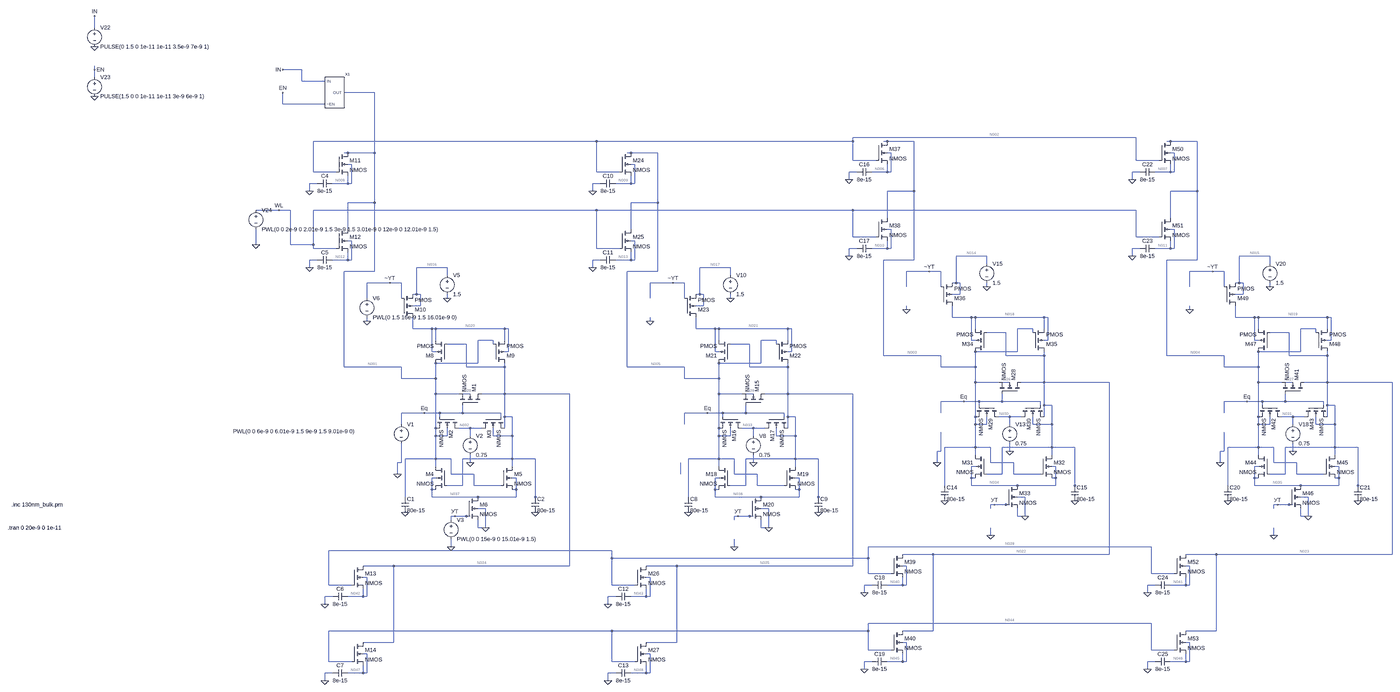
[diagram p0: schematic Draft2.asc, whole sheet]
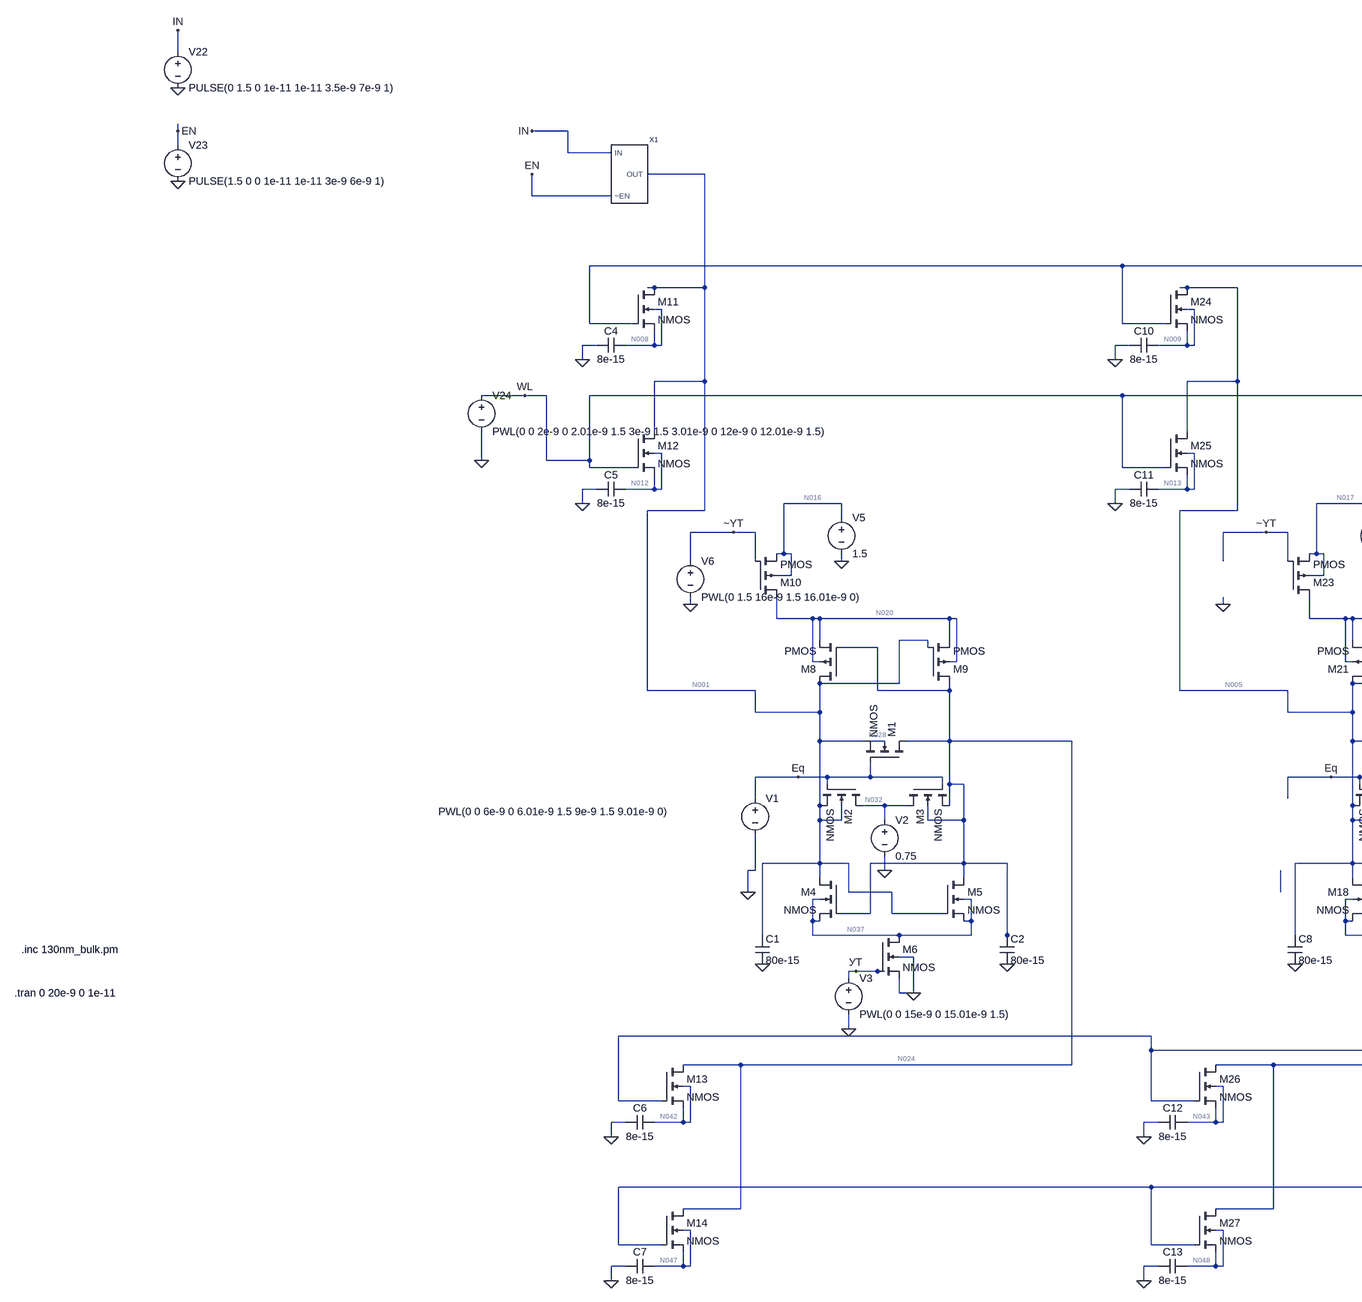
[diagram p1: schematic Draft2.asc, part, row 1 of 1, column 1 of 2]
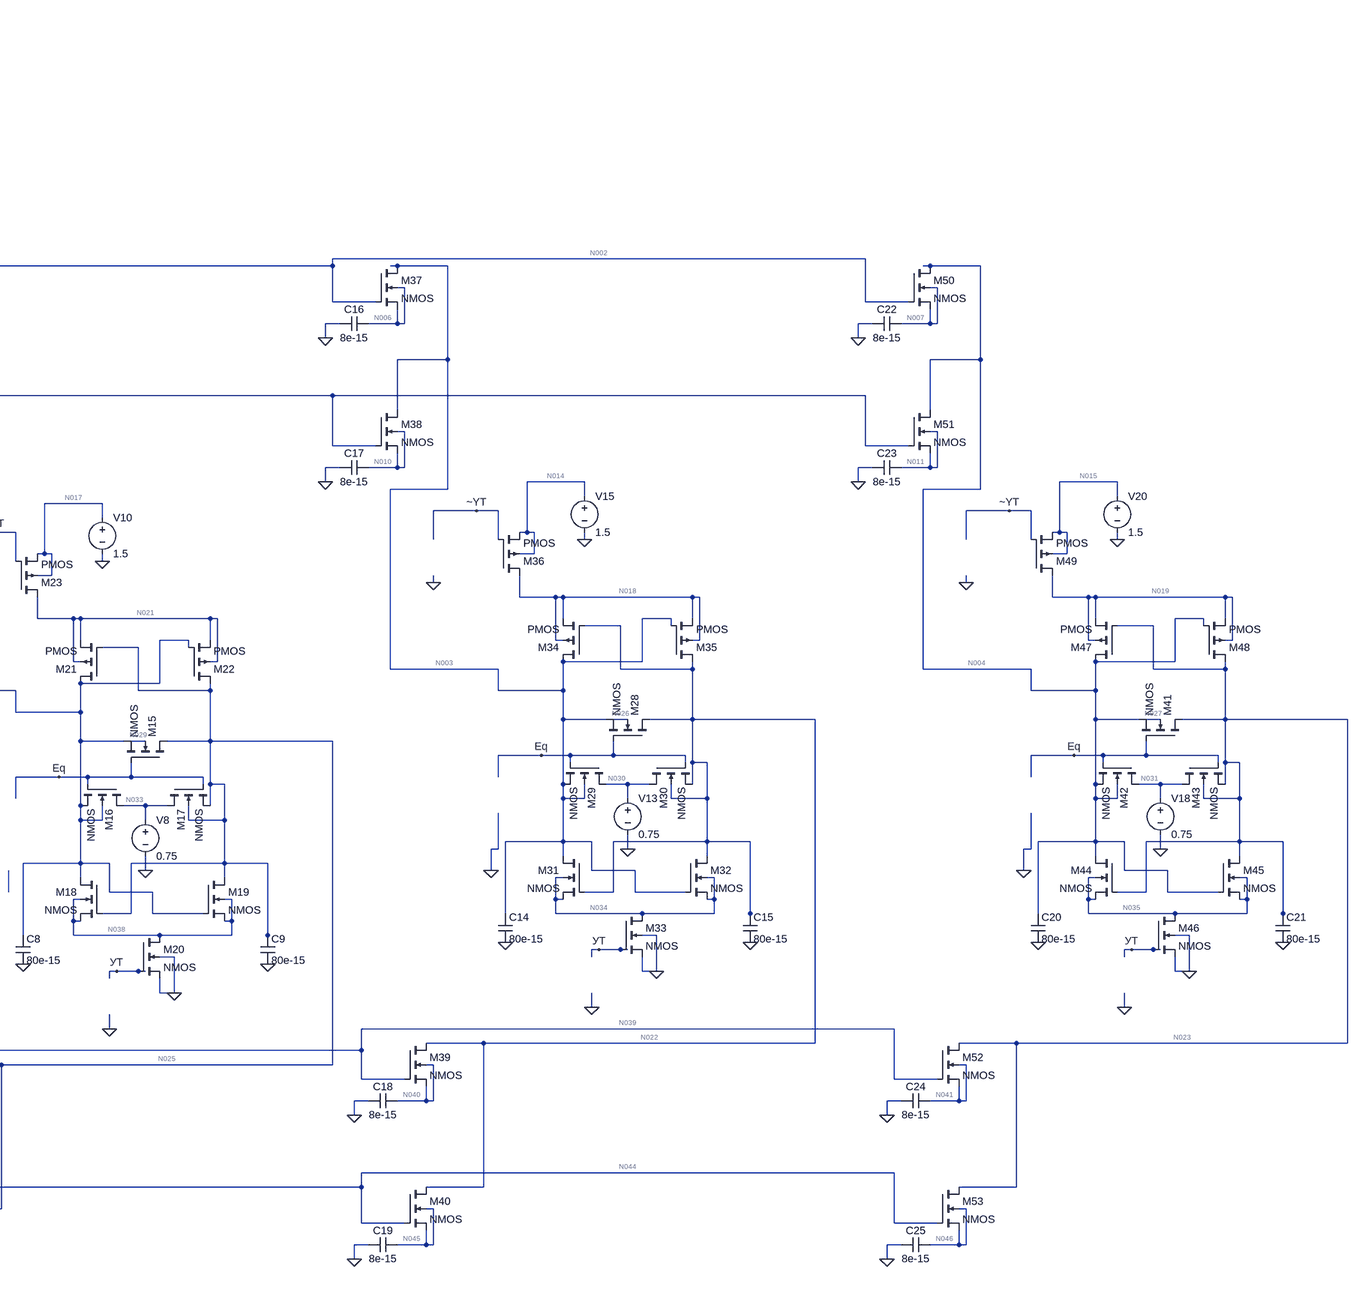
[diagram p2: schematic Draft2.asc, part, row 1 of 1, column 2 of 2]
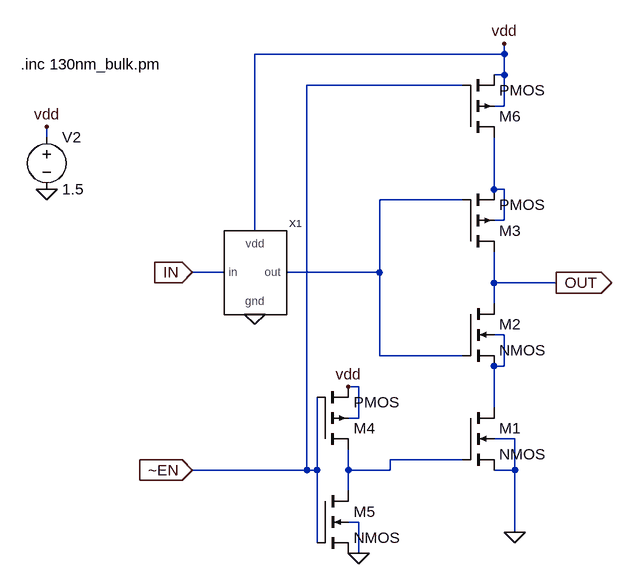
[diagram p3: sub-circuit three_state.asc]
Draft2.asc, the LTspice schematic file:
Version 4
SHEET 1 4548 1444
WIRE -928 -1360 -928 -1408
WIRE -928 -1184 -928 -1200
WIRE -16 -1184 -96 -1184
WIRE -928 -1152 -928 -1184
WIRE -16 -1136 -16 -1184
WIRE 80 -1136 -16 -1136
WIRE 288 -1088 160 -1088
WIRE -96 -1040 -96 -1088
WIRE 80 -1040 -96 -1040
WIRE 3472 -848 2288 -848
WIRE 1216 -832 32 -832
WIRE 2288 -832 2288 -848
WIRE 2288 -832 1216 -832
WIRE 2432 -832 2416 -832
WIRE 2544 -832 2432 -832
WIRE 3616 -832 3600 -832
WIRE 3728 -832 3616 -832
WIRE 176 -784 160 -784
WIRE 288 -784 288 -1088
WIRE 288 -784 176 -784
WIRE 1360 -784 1344 -784
WIRE 1472 -784 1360 -784
WIRE 2448 -784 2432 -784
WIRE 3632 -784 3616 -784
WIRE 2288 -752 2288 -832
WIRE 2384 -752 2288 -752
WIRE 3472 -752 3472 -848
WIRE 3568 -752 3472 -752
WIRE 192 -736 176 -736
WIRE 1376 -736 1360 -736
WIRE 32 -704 32 -832
WIRE 128 -704 32 -704
WIRE 1216 -704 1216 -832
WIRE 1312 -704 1216 -704
WIRE 2304 -704 2272 -704
WIRE 2432 -704 2432 -736
WIRE 2432 -704 2368 -704
WIRE 2448 -704 2448 -784
WIRE 2448 -704 2432 -704
WIRE 3488 -704 3456 -704
WIRE 3616 -704 3616 -736
WIRE 3616 -704 3552 -704
WIRE 3632 -704 3632 -784
WIRE 3632 -704 3616 -704
WIRE 2272 -672 2272 -704
WIRE 3456 -672 3456 -704
WIRE 48 -656 16 -656
WIRE 176 -656 176 -688
WIRE 176 -656 112 -656
WIRE 192 -656 192 -736
WIRE 192 -656 176 -656
WIRE 1232 -656 1200 -656
WIRE 1360 -656 1360 -688
WIRE 1360 -656 1296 -656
WIRE 1376 -656 1376 -736
WIRE 1376 -656 1360 -656
WIRE 16 -624 16 -656
WIRE 1200 -624 1200 -656
WIRE 2544 -624 2544 -832
WIRE 2544 -624 2432 -624
WIRE 3728 -624 3728 -832
WIRE 3728 -624 3616 -624
WIRE 288 -576 288 -784
WIRE 288 -576 176 -576
WIRE 1472 -576 1472 -784
WIRE 1472 -576 1360 -576
WIRE -112 -544 -208 -544
WIRE -64 -544 -112 -544
WIRE 1216 -544 32 -544
WIRE 2288 -544 1216 -544
WIRE 3472 -544 2288 -544
WIRE 2432 -512 2432 -624
WIRE 3616 -512 3616 -624
WIRE 176 -464 176 -576
WIRE 1360 -464 1360 -576
WIRE 2448 -464 2432 -464
WIRE 3632 -464 3616 -464
WIRE 2288 -432 2288 -544
WIRE 2384 -432 2288 -432
WIRE 3472 -432 3472 -544
WIRE 3568 -432 3472 -432
WIRE 192 -416 176 -416
WIRE 1376 -416 1360 -416
WIRE -208 -400 -208 -464
WIRE -64 -400 -64 -544
WIRE 32 -400 32 -544
WIRE 32 -400 -64 -400
WIRE 32 -384 32 -400
WIRE 128 -384 32 -384
WIRE 1216 -384 1216 -544
WIRE 1312 -384 1216 -384
WIRE 2304 -384 2272 -384
WIRE 2432 -384 2432 -416
WIRE 2432 -384 2368 -384
WIRE 2448 -384 2448 -464
WIRE 2448 -384 2432 -384
WIRE 3488 -384 3456 -384
WIRE 3616 -384 3616 -416
WIRE 3616 -384 3552 -384
WIRE 3632 -384 3632 -464
WIRE 3632 -384 3616 -384
WIRE 2272 -352 2272 -384
WIRE 2848 -352 2720 -352
WIRE 3456 -352 3456 -384
WIRE 4032 -352 3904 -352
WIRE 48 -336 16 -336
WIRE 176 -336 176 -368
WIRE 176 -336 112 -336
WIRE 192 -336 192 -416
WIRE 192 -336 176 -336
WIRE 1232 -336 1200 -336
WIRE 1360 -336 1360 -368
WIRE 1360 -336 1296 -336
WIRE 1376 -336 1376 -416
WIRE 1376 -336 1360 -336
WIRE 2544 -336 2544 -624
WIRE 2544 -336 2416 -336
WIRE 3728 -336 3728 -624
WIRE 3728 -336 3600 -336
WIRE 2848 -320 2848 -352
WIRE 4032 -320 4032 -352
WIRE 16 -304 16 -336
WIRE 592 -304 464 -304
WIRE 1200 -304 1200 -336
WIRE 1776 -304 1648 -304
WIRE 288 -288 288 -576
WIRE 288 -288 160 -288
WIRE 1472 -288 1472 -576
WIRE 1472 -288 1344 -288
WIRE 2608 -288 2512 -288
WIRE 2656 -288 2608 -288
WIRE 3792 -288 3696 -288
WIRE 3840 -288 3792 -288
WIRE 592 -272 592 -304
WIRE 1776 -272 1776 -304
WIRE 352 -240 256 -240
WIRE 400 -240 352 -240
WIRE 1536 -240 1440 -240
WIRE 1584 -240 1536 -240
WIRE 2720 -240 2720 -352
WIRE 2720 -240 2704 -240
WIRE 2736 -240 2720 -240
WIRE 3904 -240 3904 -352
WIRE 3904 -240 3888 -240
WIRE 3920 -240 3904 -240
WIRE 2512 -224 2512 -288
WIRE 2656 -224 2656 -288
WIRE 2848 -224 2848 -240
WIRE 3696 -224 3696 -288
WIRE 3840 -224 3840 -288
WIRE 4032 -224 4032 -240
WIRE 464 -192 464 -304
WIRE 464 -192 448 -192
WIRE 480 -192 464 -192
WIRE 1648 -192 1648 -304
WIRE 1648 -192 1632 -192
WIRE 1664 -192 1648 -192
WIRE 2736 -192 2736 -240
WIRE 2736 -192 2704 -192
WIRE 3920 -192 3920 -240
WIRE 3920 -192 3888 -192
WIRE 256 -176 256 -240
WIRE 400 -176 400 -240
WIRE 592 -176 592 -192
WIRE 1440 -176 1440 -240
WIRE 1584 -176 1584 -240
WIRE 1776 -176 1776 -192
WIRE 480 -144 480 -192
WIRE 480 -144 448 -144
WIRE 1664 -144 1664 -192
WIRE 1664 -144 1632 -144
WIRE 2512 -128 2512 -144
WIRE 3696 -128 3696 -144
WIRE 2704 -96 2704 -144
WIRE 2784 -96 2704 -96
WIRE 2800 -96 2784 -96
WIRE 3088 -96 2800 -96
WIRE 3104 -96 3088 -96
WIRE 3888 -96 3888 -144
WIRE 3968 -96 3888 -96
WIRE 3984 -96 3968 -96
WIRE 4272 -96 3984 -96
WIRE 4288 -96 4272 -96
WIRE 256 -80 256 -96
WIRE 1440 -80 1440 -96
WIRE 448 -48 448 -96
WIRE 528 -48 448 -48
WIRE 544 -48 528 -48
WIRE 832 -48 544 -48
WIRE 848 -48 832 -48
WIRE 1632 -48 1632 -96
WIRE 1712 -48 1632 -48
WIRE 1728 -48 1712 -48
WIRE 2016 -48 1728 -48
WIRE 2032 -48 2016 -48
WIRE 2800 -48 2800 -96
WIRE 3040 -48 2976 -48
WIRE 3088 -48 3088 -96
WIRE 3984 -48 3984 -96
WIRE 4224 -48 4160 -48
WIRE 4272 -48 4272 -96
WIRE 2928 -32 2848 -32
WIRE 3040 -32 3040 -48
WIRE 4112 -32 4032 -32
WIRE 4224 -32 4224 -48
WIRE 544 0 544 -48
WIRE 784 0 720 0
WIRE 832 0 832 -48
WIRE 1728 0 1728 -48
WIRE 1968 0 1904 0
WIRE 2016 0 2016 -48
WIRE 2784 0 2784 -96
WIRE 2800 0 2784 0
WIRE 3104 0 3104 -96
WIRE 3104 0 3088 0
WIRE 3968 0 3968 -96
WIRE 3984 0 3968 0
WIRE 4288 0 4288 -96
WIRE 4288 0 4272 0
WIRE 672 16 592 16
WIRE 784 16 784 0
WIRE 1856 16 1776 16
WIRE 1968 16 1968 0
WIRE 528 48 528 -48
WIRE 544 48 528 48
WIRE 848 48 848 -48
WIRE 848 48 832 48
WIRE 1712 48 1712 -48
WIRE 1728 48 1712 48
WIRE 2032 48 2032 -48
WIRE 2032 48 2016 48
WIRE 2976 48 2976 -48
WIRE 2976 48 2800 48
WIRE 4160 48 4160 -48
WIRE 4160 48 3984 48
WIRE 2416 64 2416 -336
WIRE 2656 64 2416 64
WIRE 2928 64 2928 -32
WIRE 3088 64 3088 48
WIRE 3088 64 2928 64
WIRE 3600 64 3600 -336
WIRE 3840 64 3600 64
WIRE 4112 64 4112 -32
WIRE 4272 64 4272 48
WIRE 4272 64 4112 64
WIRE 720 96 720 0
WIRE 720 96 544 96
WIRE 1904 96 1904 0
WIRE 1904 96 1728 96
WIRE 160 112 160 -288
WIRE 400 112 160 112
WIRE 672 112 672 16
WIRE 832 112 832 96
WIRE 832 112 672 112
WIRE 1344 112 1344 -288
WIRE 1584 112 1344 112
WIRE 1856 112 1856 16
WIRE 2016 112 2016 96
WIRE 2016 112 1856 112
WIRE 2656 112 2656 64
WIRE 2800 112 2800 48
WIRE 2800 112 2656 112
WIRE 3840 112 3840 64
WIRE 3984 112 3984 48
WIRE 3984 112 3840 112
WIRE 400 160 400 112
WIRE 544 160 544 96
WIRE 544 160 400 160
WIRE 1584 160 1584 112
WIRE 1728 160 1728 96
WIRE 1728 160 1584 160
WIRE 2800 176 2800 112
WIRE 2896 176 2800 176
WIRE 2944 176 2912 176
WIRE 3088 176 3088 64
WIRE 3088 176 2992 176
WIRE 3360 176 3088 176
WIRE 3984 176 3984 112
WIRE 4080 176 3984 176
WIRE 4128 176 4096 176
WIRE 4272 176 4272 64
WIRE 4272 176 4176 176
WIRE 4544 176 4272 176
WIRE 544 224 544 160
WIRE 640 224 544 224
WIRE 688 224 656 224
WIRE 832 224 832 112
WIRE 832 224 736 224
WIRE 1104 224 832 224
WIRE 1728 224 1728 160
WIRE 1824 224 1728 224
WIRE 1872 224 1840 224
WIRE 2016 224 2016 112
WIRE 2016 224 1920 224
WIRE 2288 224 2016 224
WIRE 2752 256 2656 256
WIRE 2816 256 2752 256
WIRE 2912 256 2912 224
WIRE 2912 256 2816 256
WIRE 3072 256 2912 256
WIRE 3936 256 3840 256
WIRE 4000 256 3936 256
WIRE 4096 256 4096 224
WIRE 4096 256 4000 256
WIRE 4256 256 4096 256
WIRE 2816 272 2816 256
WIRE 3072 272 3072 256
WIRE 3088 272 3088 176
WIRE 3120 272 3088 272
WIRE 4000 272 4000 256
WIRE 4256 272 4256 256
WIRE 4272 272 4272 176
WIRE 4304 272 4272 272
WIRE 496 304 400 304
WIRE 560 304 496 304
WIRE 656 304 656 272
WIRE 656 304 560 304
WIRE 816 304 656 304
WIRE 1680 304 1584 304
WIRE 1744 304 1680 304
WIRE 1840 304 1840 272
WIRE 1840 304 1744 304
WIRE 2000 304 1840 304
WIRE 2656 304 2656 256
WIRE 3840 304 3840 256
WIRE 560 320 560 304
WIRE 816 320 816 304
WIRE 832 320 832 224
WIRE 864 320 832 320
WIRE 1744 320 1744 304
WIRE 2000 320 2000 304
WIRE 2016 320 2016 224
WIRE 2048 320 2016 320
WIRE 2800 320 2800 176
WIRE 2944 320 2896 320
WIRE 2992 320 2944 320
WIRE 3088 320 3088 272
WIRE 3984 320 3984 176
WIRE 4128 320 4080 320
WIRE 4176 320 4128 320
WIRE 4272 320 4272 272
WIRE 400 352 400 304
WIRE 1584 352 1584 304
WIRE 2800 352 2800 320
WIRE 2848 352 2848 320
WIRE 2848 352 2800 352
WIRE 2944 352 2944 320
WIRE 3040 352 3040 320
WIRE 3120 352 3120 272
WIRE 3120 352 3040 352
WIRE 3984 352 3984 320
WIRE 4032 352 4032 320
WIRE 4032 352 3984 352
WIRE 4128 352 4128 320
WIRE 4224 352 4224 320
WIRE 4304 352 4304 272
WIRE 4304 352 4224 352
WIRE 544 368 544 224
WIRE 688 368 640 368
WIRE 736 368 688 368
WIRE 832 368 832 320
WIRE 1728 368 1728 224
WIRE 1872 368 1824 368
WIRE 1920 368 1872 368
WIRE 2016 368 2016 320
WIRE 544 400 544 368
WIRE 592 400 592 368
WIRE 592 400 544 400
WIRE 688 400 688 368
WIRE 784 400 784 368
WIRE 864 400 864 320
WIRE 864 400 784 400
WIRE 1728 400 1728 368
WIRE 1776 400 1776 368
WIRE 1776 400 1728 400
WIRE 1872 400 1872 368
WIRE 1968 400 1968 368
WIRE 2048 400 2048 320
WIRE 2048 400 1968 400
WIRE 2800 448 2800 352
WIRE 2800 448 2672 448
WIRE 2864 448 2800 448
WIRE 3120 448 3120 352
WIRE 3120 448 2912 448
WIRE 3216 448 3120 448
WIRE 3984 448 3984 352
WIRE 3984 448 3856 448
WIRE 4048 448 3984 448
WIRE 4304 448 4304 352
WIRE 4304 448 4096 448
WIRE 4400 448 4304 448
WIRE 2656 464 2656 384
WIRE 2656 464 2640 464
WIRE 2944 464 2944 432
WIRE 3840 464 3840 384
WIRE 3840 464 3824 464
WIRE 4128 464 4128 432
WIRE 2800 480 2800 448
WIRE 3120 480 3120 448
WIRE 3984 480 3984 448
WIRE 4304 480 4304 448
WIRE 544 496 544 400
WIRE 544 496 416 496
WIRE 608 496 544 496
WIRE 864 496 864 400
WIRE 864 496 656 496
WIRE 960 496 864 496
WIRE 1728 496 1728 400
WIRE 1728 496 1600 496
WIRE 1792 496 1728 496
WIRE 2048 496 2048 400
WIRE 2048 496 1840 496
WIRE 2144 496 2048 496
WIRE 400 512 400 432
WIRE 400 512 384 512
WIRE 688 512 688 480
WIRE 1872 512 1872 480
WIRE 2640 512 2640 464
WIRE 2864 512 2864 448
WIRE 2960 512 2864 512
WIRE 3824 512 3824 464
WIRE 4048 512 4048 448
WIRE 4144 512 4048 512
WIRE 544 528 544 496
WIRE 864 528 864 496
WIRE 1728 528 1728 496
WIRE 2048 528 2048 496
WIRE 2800 528 2784 528
WIRE 3136 528 3120 528
WIRE 3984 528 3968 528
WIRE 4320 528 4304 528
WIRE 384 560 384 512
WIRE 608 560 608 496
WIRE 704 560 608 560
WIRE 1568 560 1568 512
WIRE 1792 560 1792 496
WIRE 1888 560 1792 560
WIRE 2912 560 2912 448
WIRE 2912 560 2848 560
WIRE 2960 560 2960 512
WIRE 3072 560 2960 560
WIRE 4096 560 4096 448
WIRE 4096 560 4032 560
WIRE 4144 560 4144 512
WIRE 4256 560 4144 560
WIRE 544 576 528 576
WIRE 880 576 864 576
WIRE 1728 576 1712 576
WIRE 2064 576 2048 576
WIRE 2784 576 2784 528
WIRE 2800 576 2784 576
WIRE 3136 576 3136 528
WIRE 3136 576 3120 576
WIRE 3968 576 3968 528
WIRE 3984 576 3968 576
WIRE 4320 576 4320 528
WIRE 4320 576 4304 576
WIRE 656 608 656 496
WIRE 656 608 592 608
WIRE 704 608 704 560
WIRE 816 608 704 608
WIRE 1840 608 1840 496
WIRE 1840 608 1776 608
WIRE 1888 608 1888 560
WIRE 2000 608 1888 608
WIRE 2672 608 2672 448
WIRE 2784 608 2784 576
WIRE 2976 608 2784 608
WIRE 3136 608 3136 576
WIRE 3136 608 2976 608
WIRE 3216 608 3216 448
WIRE 3856 608 3856 448
WIRE 3968 608 3968 576
WIRE 4160 608 3968 608
WIRE 4320 608 4320 576
WIRE 4320 608 4160 608
WIRE 4400 608 4400 448
WIRE 528 624 528 576
WIRE 544 624 528 624
WIRE 880 624 880 576
WIRE 880 624 864 624
WIRE 1712 624 1712 576
WIRE 1728 624 1712 624
WIRE 2064 624 2064 576
WIRE 2064 624 2048 624
WIRE 3216 624 3216 608
WIRE 4400 624 4400 608
WIRE 416 656 416 496
WIRE 528 656 528 624
WIRE 720 656 528 656
WIRE 880 656 880 624
WIRE 880 656 720 656
WIRE 960 656 960 496
WIRE 1600 656 1600 496
WIRE 1712 656 1712 624
WIRE 1904 656 1712 656
WIRE 2064 656 2064 624
WIRE 2064 656 1904 656
WIRE 2144 656 2144 496
WIRE 3008 656 2976 656
WIRE 4192 656 4160 656
WIRE 960 672 960 656
WIRE 2144 672 2144 656
WIRE 2880 688 2864 688
WIRE 2928 688 2880 688
WIRE 2944 688 2928 688
WIRE 4064 688 4048 688
WIRE 4112 688 4064 688
WIRE 4128 688 4112 688
WIRE 752 704 720 704
WIRE 1936 704 1904 704
WIRE 2864 704 2864 688
WIRE 4048 704 4048 688
WIRE 624 736 608 736
WIRE 672 736 624 736
WIRE 688 736 672 736
WIRE 1808 736 1792 736
WIRE 1856 736 1808 736
WIRE 1872 736 1856 736
WIRE 2976 736 2976 704
WIRE 3008 736 3008 656
WIRE 3008 736 2976 736
WIRE 4160 736 4160 704
WIRE 4192 736 4192 656
WIRE 4192 736 4160 736
WIRE 608 752 608 736
WIRE 1792 752 1792 736
WIRE 720 784 720 752
WIRE 752 784 752 704
WIRE 752 784 720 784
WIRE 1904 784 1904 752
WIRE 1936 784 1936 704
WIRE 1936 784 1904 784
WIRE 2864 816 2864 784
WIRE 4048 816 4048 784
WIRE 608 864 608 832
WIRE 1792 864 1792 832
WIRE 3536 864 2352 864
WIRE 1280 880 96 880
WIRE 2624 896 2496 896
WIRE 3360 896 3360 176
WIRE 3360 896 2624 896
WIRE 3808 896 3680 896
WIRE 4544 896 4544 176
WIRE 4544 896 3808 896
WIRE 1280 912 1280 880
WIRE 2352 912 2352 864
WIRE 2352 912 1280 912
WIRE 368 944 240 944
WIRE 1104 944 1104 224
WIRE 1104 944 368 944
WIRE 1552 944 1424 944
WIRE 2288 944 2288 224
WIRE 2288 944 1552 944
WIRE 2512 944 2496 944
WIRE 3696 944 3680 944
WIRE 2352 976 2352 912
WIRE 2448 976 2352 976
WIRE 3536 976 3536 864
WIRE 3632 976 3536 976
WIRE 256 992 240 992
WIRE 1440 992 1424 992
WIRE 96 1024 96 880
WIRE 192 1024 96 1024
WIRE 1280 1024 1280 912
WIRE 1376 1024 1280 1024
WIRE 2368 1024 2336 1024
WIRE 2496 1024 2496 992
WIRE 2496 1024 2432 1024
WIRE 2512 1024 2512 944
WIRE 2512 1024 2496 1024
WIRE 3552 1024 3520 1024
WIRE 3680 1024 3680 992
WIRE 3680 1024 3616 1024
WIRE 3696 1024 3696 944
WIRE 3696 1024 3680 1024
WIRE 2336 1056 2336 1024
WIRE 3520 1056 3520 1024
WIRE 112 1072 80 1072
WIRE 240 1072 240 1040
WIRE 240 1072 176 1072
WIRE 256 1072 256 992
WIRE 256 1072 240 1072
WIRE 1296 1072 1264 1072
WIRE 1424 1072 1424 1040
WIRE 1424 1072 1360 1072
WIRE 1440 1072 1440 992
WIRE 1440 1072 1424 1072
WIRE 80 1104 80 1072
WIRE 1264 1104 1264 1072
WIRE 3536 1184 2352 1184
WIRE 1280 1216 96 1216
WIRE 2352 1216 2352 1184
WIRE 2352 1216 1280 1216
WIRE 2624 1216 2624 896
WIRE 2624 1216 2496 1216
WIRE 3808 1216 3808 896
WIRE 3808 1216 3680 1216
WIRE 368 1264 368 944
WIRE 368 1264 240 1264
WIRE 1552 1264 1552 944
WIRE 1552 1264 1424 1264
WIRE 2512 1264 2496 1264
WIRE 3696 1264 3680 1264
WIRE 2352 1296 2352 1216
WIRE 2448 1296 2352 1296
WIRE 3536 1296 3536 1184
WIRE 3632 1296 3536 1296
WIRE 256 1312 240 1312
WIRE 1440 1312 1424 1312
WIRE 96 1344 96 1216
WIRE 192 1344 96 1344
WIRE 1280 1344 1280 1216
WIRE 1376 1344 1280 1344
WIRE 2368 1344 2336 1344
WIRE 2496 1344 2496 1312
WIRE 2496 1344 2432 1344
WIRE 2512 1344 2512 1264
WIRE 2512 1344 2496 1344
WIRE 3552 1344 3520 1344
WIRE 3680 1344 3680 1312
WIRE 3680 1344 3616 1344
WIRE 3696 1344 3696 1264
WIRE 3696 1344 3680 1344
WIRE 2336 1376 2336 1344
WIRE 3520 1376 3520 1344
WIRE 112 1392 80 1392
WIRE 240 1392 240 1360
WIRE 240 1392 176 1392
WIRE 256 1392 256 1312
WIRE 256 1392 240 1392
WIRE 1296 1392 1264 1392
WIRE 1424 1392 1424 1360
WIRE 1424 1392 1360 1392
WIRE 1440 1392 1440 1312
WIRE 1440 1392 1424 1392
WIRE 80 1424 80 1392
WIRE 1264 1424 1264 1392
FLAG 384 560 0
FLAG 688 512 0
FLAG 960 720 0
FLAG 416 720 0
FLAG 752 784 0
FLAG 608 864 0
FLAG -208 -400 0
FLAG 496 304 Eq
FLAG 624 736 УТ
FLAG -112 -544 WL
FLAG 592 -176 0
FLAG 256 -80 0
FLAG 352 -240 ~YT
FLAG 16 -624 0
FLAG 16 -304 0
FLAG 80 1104 0
FLAG 80 1424 0
FLAG 1872 512 0
FLAG 2144 720 0
FLAG 1600 720 0
FLAG 1936 784 0
FLAG 1792 864 0
FLAG 1680 304 Eq
FLAG 1808 736 УТ
FLAG 1776 -176 0
FLAG 1440 -80 0
FLAG 1536 -240 ~YT
FLAG 1200 -624 0
FLAG 1200 -304 0
FLAG 1264 1104 0
FLAG 1264 1424 0
FLAG 2640 512 0
FLAG 2944 464 0
FLAG 3216 672 0
FLAG 2672 672 0
FLAG 3008 736 0
FLAG 2864 816 0
FLAG 2752 256 Eq
FLAG 2880 688 УТ
FLAG 2848 -224 0
FLAG 2512 -128 0
FLAG 2608 -288 ~YT
FLAG 2272 -672 0
FLAG 2272 -352 0
FLAG 2336 1056 0
FLAG 2336 1376 0
FLAG 3824 512 0
FLAG 4128 464 0
FLAG 4400 672 0
FLAG 3856 672 0
FLAG 4192 736 0
FLAG 4048 816 0
FLAG 3936 256 Eq
FLAG 4064 688 УТ
FLAG 4032 -224 0
FLAG 3696 -128 0
FLAG 3792 -288 ~YT
FLAG 3456 -672 0
FLAG 3456 -352 0
FLAG 3520 1056 0
FLAG 3520 1376 0
FLAG -928 -1072 0
FLAG -928 -1280 0
FLAG -928 -1184 EN
FLAG -96 -1088 EN
FLAG -96 -1184 IN
FLAG -928 -1408 IN
SYMBOL nmos4 736 272 M270
SYMATTR InstName M1
SYMATTR Value2 l=130e-9 w=1300e-9 ad=676000e-18 as=676000e-18 pd=3640e-9 ps=3640e-9
SYMBOL nmos4 640 320 R90
SYMATTR InstName M2
SYMATTR Value2 l=130e-9 w=1300e-9 ad=676000e-18 as=676000e-18 pd=3640e-9 ps=3640e-9
SYMBOL nmos4 736 320 M90
SYMATTR InstName M3
SYMATTR Value2 l=130e-9 w=1300e-9 ad=676000e-18 as=676000e-18 pd=3640e-9 ps=3640e-9
SYMBOL voltage 400 336 R0
WINDOW 3 -704 45 Left 2
WINDOW 123 0 0 Left 0
WINDOW 39 0 0 Left 0
SYMATTR Value PWL(0 0 6e-9 0 6.01e-9 1.5 9e-9 1.5 9.01e-9 0)
SYMATTR InstName V1
SYMBOL voltage 688 384 R0
WINDOW 123 0 0 Left 0
WINDOW 39 0 0 Left 0
SYMATTR InstName V2
SYMATTR Value 0.75
SYMBOL cap 400 656 R0
SYMATTR InstName C1
SYMATTR Value 80e-15
SYMBOL cap 944 656 R0
SYMATTR InstName C2
SYMATTR Value 80e-15
SYMBOL nmos4 592 528 M0
SYMATTR InstName M4
SYMATTR Value2 l=130e-9 w=1300e-9 ad=676000e-18 as=676000e-18 pd=3640e-9 ps=3640e-9
SYMBOL nmos4 816 528 R0
SYMATTR InstName M5
SYMATTR Value2 l=130e-9 w=1300e-9 ad=676000e-18 as=676000e-18 pd=3640e-9 ps=3640e-9
SYMBOL nmos4 672 656 R0
SYMATTR InstName M6
SYMATTR Value2 l=130e-9 w=1300e-9 ad=676000e-18 as=676000e-18 pd=3640e-9 ps=3640e-9
SYMBOL voltage 608 736 R0
WINDOW 123 0 0 Left 0
WINDOW 39 0 0 Left 0
SYMATTR InstName V3
SYMATTR Value PWL(0 0 15e-9 0 15.01e-9 1.5)
SYMBOL pmos4 592 96 R180
SYMATTR InstName M8
SYMATTR Value2 l=130e-9 w=2600e-9 ad=676000e-18 as=676000e-18 pd=3640e-9 ps=3640e-9
SYMBOL pmos4 784 96 M180
SYMATTR InstName M9
SYMATTR Value2 l=130e-9 w=12600e-9 ad=676000e-18 as=676000e-18 pd=3640e-9 ps=3640e-9
SYMBOL pmos4 400 -96 M180
SYMATTR InstName M10
SYMATTR Value2 l=130e-9 w=2600e-9 ad=676000e-18 as=676000e-18 pd=3640e-9 ps=3640e-9
SYMBOL voltage 592 -288 R0
WINDOW 123 0 0 Left 0
WINDOW 39 0 0 Left 0
SYMATTR InstName V5
SYMATTR Value 1.5
SYMBOL voltage 256 -192 R0
WINDOW 123 0 0 Left 0
WINDOW 39 0 0 Left 0
SYMATTR InstName V6
SYMATTR Value PWL(0 1.5 16e-9 1.5 16.01e-9 0)
SYMBOL nmos4 128 -784 R0
SYMATTR InstName M11
SYMATTR Value2 l=130e-9 w=1300e-9 ad=676000e-18 as=676000e-18 pd=3640e-9 ps=3640e-9
SYMBOL cap 112 -672 R90
WINDOW 0 0 32 VBottom 2
WINDOW 3 32 32 VTop 2
SYMATTR InstName C4
SYMATTR Value 8e-15
SYMBOL nmos4 128 -464 R0
SYMATTR InstName M12
SYMATTR Value2 l=130e-9 w=1300e-9 ad=676000e-18 as=676000e-18 pd=3640e-9 ps=3640e-9
SYMBOL cap 112 -352 R90
WINDOW 0 0 32 VBottom 2
WINDOW 3 32 32 VTop 2
SYMATTR InstName C5
SYMATTR Value 8e-15
SYMBOL nmos4 192 944 R0
SYMATTR InstName M13
SYMATTR Value2 l=130e-9 w=1300e-9 ad=676000e-18 as=676000e-18 pd=3640e-9 ps=3640e-9
SYMBOL cap 176 1056 R90
WINDOW 0 0 32 VBottom 2
WINDOW 3 32 32 VTop 2
SYMATTR InstName C6
SYMATTR Value 8e-15
SYMBOL nmos4 192 1264 R0
SYMATTR InstName M14
SYMATTR Value2 l=130e-9 w=1300e-9 ad=676000e-18 as=676000e-18 pd=3640e-9 ps=3640e-9
SYMBOL cap 176 1376 R90
WINDOW 0 0 32 VBottom 2
WINDOW 3 32 32 VTop 2
SYMATTR InstName C7
SYMATTR Value 8e-15
SYMBOL nmos4 1920 272 M270
SYMATTR InstName M15
SYMATTR Value2 l=130e-9 w=1300e-9 ad=676000e-18 as=676000e-18 pd=3640e-9 ps=3640e-9
SYMBOL nmos4 1824 320 R90
SYMATTR InstName M16
SYMATTR Value2 l=130e-9 w=1300e-9 ad=676000e-18 as=676000e-18 pd=3640e-9 ps=3640e-9
SYMBOL nmos4 1920 320 M90
SYMATTR InstName M17
SYMATTR Value2 l=130e-9 w=1300e-9 ad=676000e-18 as=676000e-18 pd=3640e-9 ps=3640e-9
SYMBOL voltage 1872 384 R0
WINDOW 123 0 0 Left 0
WINDOW 39 0 0 Left 0
SYMATTR InstName V8
SYMATTR Value 0.75
SYMBOL cap 1584 656 R0
SYMATTR InstName C8
SYMATTR Value 80e-15
SYMBOL cap 2128 656 R0
SYMATTR InstName C9
SYMATTR Value 80e-15
SYMBOL nmos4 1776 528 M0
SYMATTR InstName M18
SYMATTR Value2 l=130e-9 w=1300e-9 ad=676000e-18 as=676000e-18 pd=3640e-9 ps=3640e-9
SYMBOL nmos4 2000 528 R0
SYMATTR InstName M19
SYMATTR Value2 l=130e-9 w=1300e-9 ad=676000e-18 as=676000e-18 pd=3640e-9 ps=3640e-9
SYMBOL nmos4 1856 656 R0
SYMATTR InstName M20
SYMATTR Value2 l=130e-9 w=1300e-9 ad=676000e-18 as=676000e-18 pd=3640e-9 ps=3640e-9
SYMBOL pmos4 1776 96 R180
SYMATTR InstName M21
SYMATTR Value2 l=130e-9 w=2600e-9 ad=676000e-18 as=676000e-18 pd=3640e-9 ps=3640e-9
SYMBOL pmos4 1968 96 M180
SYMATTR InstName M22
SYMATTR Value2 l=130e-9 w=12600e-9 ad=676000e-18 as=676000e-18 pd=3640e-9 ps=3640e-9
SYMBOL pmos4 1584 -96 M180
SYMATTR InstName M23
SYMATTR Value2 l=130e-9 w=2600e-9 ad=676000e-18 as=676000e-18 pd=3640e-9 ps=3640e-9
SYMBOL voltage 1776 -288 R0
WINDOW 123 0 0 Left 0
WINDOW 39 0 0 Left 0
SYMATTR InstName V10
SYMATTR Value 1.5
SYMBOL nmos4 1312 -784 R0
SYMATTR InstName M24
SYMATTR Value2 l=130e-9 w=1300e-9 ad=676000e-18 as=676000e-18 pd=3640e-9 ps=3640e-9
SYMBOL cap 1296 -672 R90
WINDOW 0 0 32 VBottom 2
WINDOW 3 32 32 VTop 2
SYMATTR InstName C10
SYMATTR Value 8e-15
SYMBOL nmos4 1312 -464 R0
SYMATTR InstName M25
SYMATTR Value2 l=130e-9 w=1300e-9 ad=676000e-18 as=676000e-18 pd=3640e-9 ps=3640e-9
SYMBOL cap 1296 -352 R90
WINDOW 0 0 32 VBottom 2
WINDOW 3 32 32 VTop 2
SYMATTR InstName C11
SYMATTR Value 8e-15
SYMBOL nmos4 1376 944 R0
SYMATTR InstName M26
SYMATTR Value2 l=130e-9 w=1300e-9 ad=676000e-18 as=676000e-18 pd=3640e-9 ps=3640e-9
SYMBOL cap 1360 1056 R90
WINDOW 0 0 32 VBottom 2
WINDOW 3 32 32 VTop 2
SYMATTR InstName C12
SYMATTR Value 8e-15
SYMBOL nmos4 1376 1264 R0
SYMATTR InstName M27
SYMATTR Value2 l=130e-9 w=1300e-9 ad=676000e-18 as=676000e-18 pd=3640e-9 ps=3640e-9
SYMBOL cap 1360 1376 R90
WINDOW 0 0 32 VBottom 2
WINDOW 3 32 32 VTop 2
SYMATTR InstName C13
SYMATTR Value 8e-15
SYMBOL nmos4 2992 224 M270
SYMATTR InstName M28
SYMATTR Value2 l=130e-9 w=1300e-9 ad=676000e-18 as=676000e-18 pd=3640e-9 ps=3640e-9
SYMBOL nmos4 2896 272 R90
SYMATTR InstName M29
SYMATTR Value2 l=130e-9 w=1300e-9 ad=676000e-18 as=676000e-18 pd=3640e-9 ps=3640e-9
SYMBOL nmos4 2992 272 M90
SYMATTR InstName M30
SYMATTR Value2 l=130e-9 w=1300e-9 ad=676000e-18 as=676000e-18 pd=3640e-9 ps=3640e-9
SYMBOL voltage 2944 336 R0
WINDOW 123 0 0 Left 0
WINDOW 39 0 0 Left 0
SYMATTR InstName V13
SYMATTR Value 0.75
SYMBOL cap 2656 608 R0
SYMATTR InstName C14
SYMATTR Value 80e-15
SYMBOL cap 3200 608 R0
SYMATTR InstName C15
SYMATTR Value 80e-15
SYMBOL nmos4 2848 480 M0
SYMATTR InstName M31
SYMATTR Value2 l=130e-9 w=1300e-9 ad=676000e-18 as=676000e-18 pd=3640e-9 ps=3640e-9
SYMBOL nmos4 3072 480 R0
SYMATTR InstName M32
SYMATTR Value2 l=130e-9 w=1300e-9 ad=676000e-18 as=676000e-18 pd=3640e-9 ps=3640e-9
SYMBOL nmos4 2928 608 R0
SYMATTR InstName M33
SYMATTR Value2 l=130e-9 w=1300e-9 ad=676000e-18 as=676000e-18 pd=3640e-9 ps=3640e-9
SYMBOL pmos4 2848 48 R180
SYMATTR InstName M34
SYMATTR Value2 l=130e-9 w=2600e-9 ad=676000e-18 as=676000e-18 pd=3640e-9 ps=3640e-9
SYMBOL pmos4 3040 48 M180
SYMATTR InstName M35
SYMATTR Value2 l=130e-9 w=12600e-9 ad=676000e-18 as=676000e-18 pd=3640e-9 ps=3640e-9
SYMBOL pmos4 2656 -144 M180
SYMATTR InstName M36
SYMATTR Value2 l=130e-9 w=2600e-9 ad=676000e-18 as=676000e-18 pd=3640e-9 ps=3640e-9
SYMBOL voltage 2848 -336 R0
WINDOW 123 0 0 Left 0
WINDOW 39 0 0 Left 0
SYMATTR InstName V15
SYMATTR Value 1.5
SYMBOL nmos4 2384 -832 R0
SYMATTR InstName M37
SYMATTR Value2 l=130e-9 w=1300e-9 ad=676000e-18 as=676000e-18 pd=3640e-9 ps=3640e-9
SYMBOL cap 2368 -720 R90
WINDOW 0 0 32 VBottom 2
WINDOW 3 32 32 VTop 2
SYMATTR InstName C16
SYMATTR Value 8e-15
SYMBOL nmos4 2384 -512 R0
SYMATTR InstName M38
SYMATTR Value2 l=130e-9 w=1300e-9 ad=676000e-18 as=676000e-18 pd=3640e-9 ps=3640e-9
SYMBOL cap 2368 -400 R90
WINDOW 0 0 32 VBottom 2
WINDOW 3 32 32 VTop 2
SYMATTR InstName C17
SYMATTR Value 8e-15
SYMBOL nmos4 2448 896 R0
SYMATTR InstName M39
SYMATTR Value2 l=130e-9 w=1300e-9 ad=676000e-18 as=676000e-18 pd=3640e-9 ps=3640e-9
SYMBOL cap 2432 1008 R90
WINDOW 0 0 32 VBottom 2
WINDOW 3 32 32 VTop 2
SYMATTR InstName C18
SYMATTR Value 8e-15
SYMBOL nmos4 2448 1216 R0
SYMATTR InstName M40
SYMATTR Value2 l=130e-9 w=1300e-9 ad=676000e-18 as=676000e-18 pd=3640e-9 ps=3640e-9
SYMBOL cap 2432 1328 R90
WINDOW 0 0 32 VBottom 2
WINDOW 3 32 32 VTop 2
SYMATTR InstName C19
SYMATTR Value 8e-15
SYMBOL nmos4 4176 224 M270
SYMATTR InstName M41
SYMATTR Value2 l=130e-9 w=1300e-9 ad=676000e-18 as=676000e-18 pd=3640e-9 ps=3640e-9
SYMBOL nmos4 4080 272 R90
SYMATTR InstName M42
SYMATTR Value2 l=130e-9 w=1300e-9 ad=676000e-18 as=676000e-18 pd=3640e-9 ps=3640e-9
SYMBOL nmos4 4176 272 M90
SYMATTR InstName M43
SYMATTR Value2 l=130e-9 w=1300e-9 ad=676000e-18 as=676000e-18 pd=3640e-9 ps=3640e-9
SYMBOL voltage 4128 336 R0
WINDOW 123 0 0 Left 0
WINDOW 39 0 0 Left 0
SYMATTR InstName V18
SYMATTR Value 0.75
SYMBOL cap 3840 608 R0
SYMATTR InstName C20
SYMATTR Value 80e-15
SYMBOL cap 4384 608 R0
SYMATTR InstName C21
SYMATTR Value 80e-15
SYMBOL nmos4 4032 480 M0
SYMATTR InstName M44
SYMATTR Value2 l=130e-9 w=1300e-9 ad=676000e-18 as=676000e-18 pd=3640e-9 ps=3640e-9
SYMBOL nmos4 4256 480 R0
SYMATTR InstName M45
SYMATTR Value2 l=130e-9 w=1300e-9 ad=676000e-18 as=676000e-18 pd=3640e-9 ps=3640e-9
SYMBOL nmos4 4112 608 R0
SYMATTR InstName M46
SYMATTR Value2 l=130e-9 w=1300e-9 ad=676000e-18 as=676000e-18 pd=3640e-9 ps=3640e-9
SYMBOL pmos4 4032 48 R180
SYMATTR InstName M47
SYMATTR Value2 l=130e-9 w=2600e-9 ad=676000e-18 as=676000e-18 pd=3640e-9 ps=3640e-9
SYMBOL pmos4 4224 48 M180
SYMATTR InstName M48
SYMATTR Value2 l=130e-9 w=12600e-9 ad=676000e-18 as=676000e-18 pd=3640e-9 ps=3640e-9
SYMBOL pmos4 3840 -144 M180
SYMATTR InstName M49
SYMATTR Value2 l=130e-9 w=2600e-9 ad=676000e-18 as=676000e-18 pd=3640e-9 ps=3640e-9
SYMBOL voltage 4032 -336 R0
WINDOW 123 0 0 Left 0
WINDOW 39 0 0 Left 0
SYMATTR InstName V20
SYMATTR Value 1.5
SYMBOL nmos4 3568 -832 R0
SYMATTR InstName M50
SYMATTR Value2 l=130e-9 w=1300e-9 ad=676000e-18 as=676000e-18 pd=3640e-9 ps=3640e-9
SYMBOL cap 3552 -720 R90
WINDOW 0 0 32 VBottom 2
WINDOW 3 32 32 VTop 2
SYMATTR InstName C22
SYMATTR Value 8e-15
SYMBOL nmos4 3568 -512 R0
SYMATTR InstName M51
SYMATTR Value2 l=130e-9 w=1300e-9 ad=676000e-18 as=676000e-18 pd=3640e-9 ps=3640e-9
SYMBOL cap 3552 -400 R90
WINDOW 0 0 32 VBottom 2
WINDOW 3 32 32 VTop 2
SYMATTR InstName C23
SYMATTR Value 8e-15
SYMBOL nmos4 3632 896 R0
SYMATTR InstName M52
SYMATTR Value2 l=130e-9 w=1300e-9 ad=676000e-18 as=676000e-18 pd=3640e-9 ps=3640e-9
SYMBOL cap 3616 1008 R90
WINDOW 0 0 32 VBottom 2
WINDOW 3 32 32 VTop 2
SYMATTR InstName C24
SYMATTR Value 8e-15
SYMBOL nmos4 3632 1216 R0
SYMATTR InstName M53
SYMATTR Value2 l=130e-9 w=1300e-9 ad=676000e-18 as=676000e-18 pd=3640e-9 ps=3640e-9
SYMBOL cap 3616 1328 R90
WINDOW 0 0 32 VBottom 2
WINDOW 3 32 32 VTop 2
SYMATTR InstName C25
SYMATTR Value 8e-15
SYMBOL voltage -928 -1376 R0
WINDOW 123 0 0 Left 0
WINDOW 39 0 0 Left 0
SYMATTR InstName V22
SYMATTR Value PULSE(0 1.5 0 1e-11 1e-11 3.5e-9 7e-9 1)
SYMBOL voltage -928 -1168 R0
WINDOW 123 0 0 Left 0
WINDOW 39 0 0 Left 0
SYMATTR InstName V23
SYMATTR Value PULSE(1.5 0 0 1e-11 1e-11 3e-9 6e-9 1)
SYMBOL three_state 144 -1056 R0
SYMATTR InstName X1
SYMBOL voltage -208 -560 R0
WINDOW 123 0 0 Left 0
WINDOW 39 0 0 Left 0
SYMATTR InstName V24
SYMATTR Value PWL(0 0 2e-9 0 2.01e-9 1.5 3e-9 1.5 3.01e-9 0 12e-9 0 12.01e-9 1.5)
TEXT -1512 688 Left 2 !.inc 130nm_bulk.pm
TEXT -1528 784 Left 2 !.tran 0 20e-9 0 1e-11

three_state.asc, the sub-circuit schematic file:
Version 4
SHEET 1 880 680
WIRE 48 -480 48 -496
WIRE 48 -480 -336 -480
WIRE 48 -448 48 -480
WIRE 48 -448 32 -448
WIRE -16 -432 -256 -432
WIRE 48 -400 48 -448
WIRE 48 -400 32 -400
WIRE -656 -352 -656 -368
WIRE 32 -272 32 -352
WIRE 48 -272 32 -272
WIRE -16 -256 -144 -256
WIRE 48 -224 48 -272
WIRE 48 -224 32 -224
WIRE -336 -208 -336 -480
WIRE -384 -144 -432 -144
WIRE -144 -144 -144 -256
WIRE -144 -144 -288 -144
WIRE 32 -128 32 -176
WIRE 128 -128 32 -128
WIRE 32 -96 32 -128
WIRE 48 -48 32 -48
WIRE -144 -16 -144 -144
WIRE -16 -16 -144 -16
WIRE 48 0 48 -48
WIRE 48 0 32 0
WIRE -176 32 -192 32
WIRE 32 64 32 0
WIRE -176 80 -176 32
WIRE -176 80 -192 80
WIRE 64 112 32 112
WIRE -16 144 -128 144
WIRE -256 160 -256 -432
WIRE -256 160 -432 160
WIRE -240 160 -240 48
WIRE -240 160 -256 160
WIRE -192 160 -192 128
WIRE -128 160 -128 144
WIRE -128 160 -192 160
WIRE 64 160 64 112
WIRE 64 160 32 160
WIRE -192 192 -192 160
WIRE -176 240 -192 240
WIRE 64 256 64 160
WIRE -240 272 -240 160
WIRE -176 288 -176 240
WIRE -176 288 -192 288
FLAG -656 -368 vdd
FLAG -656 -272 0
FLAG -176 288 0
FLAG -192 32 vdd
FLAG 48 -496 vdd
FLAG 64 256 0
FLAG -432 -144 IN
IOPIN -432 -144 In
FLAG -432 160 ~EN
IOPIN -432 160 In
FLAG 128 -128 OUT
IOPIN 128 -128 Out
FLAG -336 -80 0
SYMBOL voltage -656 -368 R0
WINDOW 123 0 0 Left 0
WINDOW 39 0 0 Left 0
SYMATTR InstName V2
SYMATTR Value 1.5
SYMBOL pmos4 -240 128 M180
SYMATTR InstName M4
SYMATTR Value2 l=130e-9 w=2600e-9 ad=676000e-18 as=676000e-18 pd=3640e-9 ps=3640e-9
SYMBOL nmos4 -240 192 R0
SYMATTR InstName M5
SYMATTR Value2 l=130e-9 w=1300e-9 ad=676000e-18 as=676000e-18 pd=3640e-9 ps=3640e-9
SYMBOL nmos4 -16 64 R0
SYMATTR InstName M1
SYMATTR Value2 l=130e-9 w=1300e-9 ad=676000e-18 as=676000e-18 pd=3640e-9 ps=3640e-9
SYMBOL nmos4 -16 -96 R0
SYMATTR InstName M2
SYMATTR Value2 l=130e-9 w=1300e-9 ad=676000e-18 as=676000e-18 pd=3640e-9 ps=3640e-9
SYMBOL pmos4 -16 -176 M180
SYMATTR InstName M3
SYMATTR Value2 l=130e-9 w=2600e-9 ad=676000e-18 as=676000e-18 pd=3640e-9 ps=3640e-9
SYMBOL pmos4 -16 -352 M180
SYMATTR InstName M6
SYMATTR Value2 l=130e-9 w=2600e-9 ad=676000e-18 as=676000e-18 pd=3640e-9 ps=3640e-9
SYMBOL invert -336 -144 R0
SYMATTR InstName X1
TEXT -696 -464 Left 2 !.inc 130nm_bulk.pm

The netlist it stands for:
* Draft2.asc
M1 N024 Eq N001 N028 NMOS l=130e-9 w=1300e-9 ad=676000e-18 as=676000e-18 pd=3640e-9 ps=3640e-9
M2 N032 Eq N001 N001 NMOS l=130e-9 w=1300e-9 ad=676000e-18 as=676000e-18 pd=3640e-9 ps=3640e-9
M3 N032 Eq N024 N024 NMOS l=130e-9 w=1300e-9 ad=676000e-18 as=676000e-18 pd=3640e-9 ps=3640e-9
V1 Eq 0 PWL(0 0 6e-9 0 6.01e-9 1.5 9e-9 1.5 9.01e-9 0)
V2 N032 0 0.75
C1 N001 0 80e-15
C2 N024 0 80e-15
M4 N001 N024 N037 N037 NMOS l=130e-9 w=1300e-9 ad=676000e-18 as=676000e-18 pd=3640e-9 ps=3640e-9
M5 N024 N001 N037 N037 NMOS l=130e-9 w=1300e-9 ad=676000e-18 as=676000e-18 pd=3640e-9 ps=3640e-9
M6 N037 УТ 0 0 NMOS l=130e-9 w=1300e-9 ad=676000e-18 as=676000e-18 pd=3640e-9 ps=3640e-9
V3 УТ 0 PWL(0 0 15e-9 0 15.01e-9 1.5)
M8 N001 N024 N020 N020 PMOS l=130e-9 w=2600e-9 ad=676000e-18 as=676000e-18 pd=3640e-9 ps=3640e-9
M9 N024 N001 N020 N020 PMOS l=130e-9 w=12600e-9 ad=676000e-18 as=676000e-18 pd=3640e-9 ps=3640e-9
M10 N020 ~YT N016 N016 PMOS l=130e-9 w=2600e-9 ad=676000e-18 as=676000e-18 pd=3640e-9 ps=3640e-9
V5 N016 0 1.5
V6 ~YT 0 PWL(0 1.5 16e-9 1.5 16.01e-9 0)
M11 N001 N002 N008 N008 NMOS l=130e-9 w=1300e-9 ad=676000e-18 as=676000e-18 pd=3640e-9 ps=3640e-9
C4 N008 0 8e-15
M12 N001 WL N012 N012 NMOS l=130e-9 w=1300e-9 ad=676000e-18 as=676000e-18 pd=3640e-9 ps=3640e-9
C5 N012 0 8e-15
M13 N024 N039 N042 N042 NMOS l=130e-9 w=1300e-9 ad=676000e-18 as=676000e-18 pd=3640e-9 ps=3640e-9
C6 N042 0 8e-15
M14 N024 N044 N047 N047 NMOS l=130e-9 w=1300e-9 ad=676000e-18 as=676000e-18 pd=3640e-9 ps=3640e-9
C7 N047 0 8e-15
M15 N025 Eq N005 N029 NMOS l=130e-9 w=1300e-9 ad=676000e-18 as=676000e-18 pd=3640e-9 ps=3640e-9
M16 N033 Eq N005 N005 NMOS l=130e-9 w=1300e-9 ad=676000e-18 as=676000e-18 pd=3640e-9 ps=3640e-9
M17 N033 Eq N025 N025 NMOS l=130e-9 w=1300e-9 ad=676000e-18 as=676000e-18 pd=3640e-9 ps=3640e-9
V8 N033 0 0.75
C8 N005 0 80e-15
C9 N025 0 80e-15
M18 N005 N025 N038 N038 NMOS l=130e-9 w=1300e-9 ad=676000e-18 as=676000e-18 pd=3640e-9 ps=3640e-9
M19 N025 N005 N038 N038 NMOS l=130e-9 w=1300e-9 ad=676000e-18 as=676000e-18 pd=3640e-9 ps=3640e-9
M20 N038 УТ 0 0 NMOS l=130e-9 w=1300e-9 ad=676000e-18 as=676000e-18 pd=3640e-9 ps=3640e-9
M21 N005 N025 N021 N021 PMOS l=130e-9 w=2600e-9 ad=676000e-18 as=676000e-18 pd=3640e-9 ps=3640e-9
M22 N025 N005 N021 N021 PMOS l=130e-9 w=12600e-9 ad=676000e-18 as=676000e-18 pd=3640e-9 ps=3640e-9
M23 N021 ~YT N017 N017 PMOS l=130e-9 w=2600e-9 ad=676000e-18 as=676000e-18 pd=3640e-9 ps=3640e-9
V10 N017 0 1.5
M24 N005 N002 N009 N009 NMOS l=130e-9 w=1300e-9 ad=676000e-18 as=676000e-18 pd=3640e-9 ps=3640e-9
C10 N009 0 8e-15
M25 N005 WL N013 N013 NMOS l=130e-9 w=1300e-9 ad=676000e-18 as=676000e-18 pd=3640e-9 ps=3640e-9
C11 N013 0 8e-15
M26 N025 N039 N043 N043 NMOS l=130e-9 w=1300e-9 ad=676000e-18 as=676000e-18 pd=3640e-9 ps=3640e-9
C12 N043 0 8e-15
M27 N025 N044 N048 N048 NMOS l=130e-9 w=1300e-9 ad=676000e-18 as=676000e-18 pd=3640e-9 ps=3640e-9
C13 N048 0 8e-15
M28 N022 Eq N003 N026 NMOS l=130e-9 w=1300e-9 ad=676000e-18 as=676000e-18 pd=3640e-9 ps=3640e-9
M29 N030 Eq N003 N003 NMOS l=130e-9 w=1300e-9 ad=676000e-18 as=676000e-18 pd=3640e-9 ps=3640e-9
M30 N030 Eq N022 N022 NMOS l=130e-9 w=1300e-9 ad=676000e-18 as=676000e-18 pd=3640e-9 ps=3640e-9
V13 N030 0 0.75
C14 N003 0 80e-15
C15 N022 0 80e-15
M31 N003 N022 N034 N034 NMOS l=130e-9 w=1300e-9 ad=676000e-18 as=676000e-18 pd=3640e-9 ps=3640e-9
M32 N022 N003 N034 N034 NMOS l=130e-9 w=1300e-9 ad=676000e-18 as=676000e-18 pd=3640e-9 ps=3640e-9
M33 N034 УТ 0 0 NMOS l=130e-9 w=1300e-9 ad=676000e-18 as=676000e-18 pd=3640e-9 ps=3640e-9
M34 N003 N022 N018 N018 PMOS l=130e-9 w=2600e-9 ad=676000e-18 as=676000e-18 pd=3640e-9 ps=3640e-9
M35 N022 N003 N018 N018 PMOS l=130e-9 w=12600e-9 ad=676000e-18 as=676000e-18 pd=3640e-9 ps=3640e-9
M36 N018 ~YT N014 N014 PMOS l=130e-9 w=2600e-9 ad=676000e-18 as=676000e-18 pd=3640e-9 ps=3640e-9
V15 N014 0 1.5
M37 N003 N002 N006 N006 NMOS l=130e-9 w=1300e-9 ad=676000e-18 as=676000e-18 pd=3640e-9 ps=3640e-9
C16 N006 0 8e-15
M38 N003 WL N010 N010 NMOS l=130e-9 w=1300e-9 ad=676000e-18 as=676000e-18 pd=3640e-9 ps=3640e-9
C17 N010 0 8e-15
M39 N022 N039 N040 N040 NMOS l=130e-9 w=1300e-9 ad=676000e-18 as=676000e-18 pd=3640e-9 ps=3640e-9
C18 N040 0 8e-15
M40 N022 N044 N045 N045 NMOS l=130e-9 w=1300e-9 ad=676000e-18 as=676000e-18 pd=3640e-9 ps=3640e-9
C19 N045 0 8e-15
M41 N023 Eq N004 N027 NMOS l=130e-9 w=1300e-9 ad=676000e-18 as=676000e-18 pd=3640e-9 ps=3640e-9
M42 N031 Eq N004 N004 NMOS l=130e-9 w=1300e-9 ad=676000e-18 as=676000e-18 pd=3640e-9 ps=3640e-9
M43 N031 Eq N023 N023 NMOS l=130e-9 w=1300e-9 ad=676000e-18 as=676000e-18 pd=3640e-9 ps=3640e-9
V18 N031 0 0.75
C20 N004 0 80e-15
C21 N023 0 80e-15
M44 N004 N023 N035 N035 NMOS l=130e-9 w=1300e-9 ad=676000e-18 as=676000e-18 pd=3640e-9 ps=3640e-9
M45 N023 N004 N035 N035 NMOS l=130e-9 w=1300e-9 ad=676000e-18 as=676000e-18 pd=3640e-9 ps=3640e-9
M46 N035 УТ 0 0 NMOS l=130e-9 w=1300e-9 ad=676000e-18 as=676000e-18 pd=3640e-9 ps=3640e-9
M47 N004 N023 N019 N019 PMOS l=130e-9 w=2600e-9 ad=676000e-18 as=676000e-18 pd=3640e-9 ps=3640e-9
M48 N023 N004 N019 N019 PMOS l=130e-9 w=12600e-9 ad=676000e-18 as=676000e-18 pd=3640e-9 ps=3640e-9
M49 N019 ~YT N015 N015 PMOS l=130e-9 w=2600e-9 ad=676000e-18 as=676000e-18 pd=3640e-9 ps=3640e-9
V20 N015 0 1.5
M50 N004 N002 N007 N007 NMOS l=130e-9 w=1300e-9 ad=676000e-18 as=676000e-18 pd=3640e-9 ps=3640e-9
C22 N007 0 8e-15
M51 N004 WL N011 N011 NMOS l=130e-9 w=1300e-9 ad=676000e-18 as=676000e-18 pd=3640e-9 ps=3640e-9
C23 N011 0 8e-15
M52 N023 N039 N041 N041 NMOS l=130e-9 w=1300e-9 ad=676000e-18 as=676000e-18 pd=3640e-9 ps=3640e-9
C24 N041 0 8e-15
M53 N023 N044 N046 N046 NMOS l=130e-9 w=1300e-9 ad=676000e-18 as=676000e-18 pd=3640e-9 ps=3640e-9
C25 N046 0 8e-15
V22 IN 0 PULSE(0 1.5 0 1e-11 1e-11 3.5e-9 7e-9 1)
V23 EN 0 PULSE(1.5 0 0 1e-11 1e-11 3e-9 6e-9 1)
XX1 IN EN N001 three_state
V24 WL 0 PWL(0 0 2e-9 0 2.01e-9 1.5 3e-9 1.5 3.01e-9 0 12e-9 0 12.01e-9 1.5)

* block symbol definitions
.subckt three_state IN ~EN OUT
V2 vdd 0 1.5
M4 N004 ~EN vdd vdd PMOS l=130e-9 w=2600e-9 ad=676000e-18 as=676000e-18 pd=3640e-9 ps=3640e-9
M5 N004 ~EN 0 0 NMOS l=130e-9 w=1300e-9 ad=676000e-18 as=676000e-18 pd=3640e-9 ps=3640e-9
M1 N003 N004 0 0 NMOS l=130e-9 w=1300e-9 ad=676000e-18 as=676000e-18 pd=3640e-9 ps=3640e-9
M2 OUT N002 N003 N003 NMOS l=130e-9 w=1300e-9 ad=676000e-18 as=676000e-18 pd=3640e-9 ps=3640e-9
M3 OUT N002 N001 N001 PMOS l=130e-9 w=2600e-9 ad=676000e-18 as=676000e-18 pd=3640e-9 ps=3640e-9
M6 N001 ~EN vdd vdd PMOS l=130e-9 w=2600e-9 ad=676000e-18 as=676000e-18 pd=3640e-9 ps=3640e-9
XX1 IN vdd 0 N002 invert  ; pins in vdd gnd out
.inc 130nm_bulk.pm
.ends three_state

.model NMOS NMOS
.model PMOS PMOS
.lib standard.mos
.inc 130nm_bulk.pm
.tran 0 20e-9 0 1e-11
.backanno
.end

* Results of the author's LTspice run, read from the files saved beside the schematic
* Operating Point, zero values left out:
*   V(n024) = 862.7 mV
*   V(n001) = 498.6 mV
*   V(n028) = 453.9 mV
*   V(n032) = 750 mV
*   V(n037) = 498.6 mV
*   V(n020) = 862.7 mV
*   V(~yt) = 1.5 V
*   V(n016) = 1.5 V
*   V(n002) = 483.4 mV
*   V(n008) = 498.6 mV
*   V(n012) = 303.8 mV
*   V(n039) = 764 mV
*   V(n042) = 862.7 mV
*   V(n044) = 764 mV
*   V(n047) = 862.7 mV
*   V(n025) = 917 mV
*   V(n005) = 617.1 mV
*   V(n029) = 511.5 mV
*   V(n033) = 750 mV
*   V(n038) = 617.1 mV
*   V(n021) = 917 mV
*   V(n017) = 1.5 V
*   V(n009) = 617.1 mV
*   V(n013) = 312.9 mV
*   V(n043) = 916.9 mV
*   V(n048) = 916.9 mV
*   V(n022) = 917 mV
*   V(n003) = 617.1 mV
*   V(n026) = 511.5 mV
*   V(n030) = 750 mV
*   V(n034) = 617.1 mV
*   V(n018) = 917 mV
*   V(n014) = 1.5 V
*   V(n006) = 617.1 mV
*   V(n010) = 312.9 mV
*   V(n040) = 916.9 mV
*   V(n045) = 916.9 mV
*   V(n023) = 917 mV
*   V(n004) = 617.1 mV
*   V(n027) = 511.5 mV
*   V(n031) = 750 mV
*   V(n035) = 617.1 mV
*   V(n019) = 917 mV
*   V(n015) = 1.5 V
*   V(n007) = 617.1 mV
*   V(n011) = 312.9 mV
*   V(n041) = 916.9 mV
*   V(n046) = 916.9 mV
*   V(en) = 1.5 V
*   Id(M49) = -9.263 nA
*   Is(M49) = 9.263 nA
*   Id(M48) = -4.87 nA
*   Is(M48) = 4.87 nA
*   Id(M47) = -4.394 nA
*   Is(M47) = 4.393 nA
*   Id(M36) = -9.263 nA
*   Is(M36) = 9.263 nA
*   Id(M35) = -4.87 nA
*   Is(M35) = 4.87 nA
*   Id(M34) = -4.394 nA
*   Is(M34) = 4.393 nA
*   Id(M23) = -9.263 nA
*   Is(M23) = 9.263 nA
*   Id(M22) = -4.87 nA
*   Is(M22) = 4.87 nA
*   Id(M21) = -4.394 nA
*   Is(M21) = 4.393 nA
*   Id(M10) = -10.66 nA
*   Is(M10) = 10.66 nA
*   Id(M9) = -5.447 nA
*   Is(M9) = 5.447 nA
*   Id(M8) = -5.216 nA
*   Is(M8) = 5.215 nA
*   Id(M51) = 17.27 pA
*   Ig(M51) = -17.27 pA
*   Id(M46) = 8.92 nA
*   Ig(M46) = -16.26 pA
*   Is(M46) = -8.903 nA
*   Id(M45) = 4.574 nA
*   Is(M45) = -4.573 nA
*   Id(M44) = 4.345 nA
*   Ig(M44) = 1.772 pA
*   Is(M44) = -4.347 nA
*   Id(M43) = 44.35 pA
*   Ig(M43) = -191.3 pA
*   Ib(M43) = 1.243 pA
*   Is(M43) = 145.7 pA
*   Id(M42) = 44.79 pA
*   Ig(M42) = -60.92 pA
*   Is(M42) = 16.26 pA
*   Id(M41) = 146.1 pA
*   Ig(M41) = -161.9 pA
*   Is(M41) = 16.37 pA
*   Id(M38) = 17.27 pA
*   Ig(M38) = -17.27 pA
*   Id(M33) = 8.92 nA
*   Ig(M33) = -16.26 pA
*   Is(M33) = -8.903 nA
*   Id(M32) = 4.574 nA
*   Is(M32) = -4.573 nA
*   Id(M31) = 4.345 nA
*   Ig(M31) = 1.772 pA
*   Is(M31) = -4.347 nA
*   Id(M30) = 44.35 pA
*   Ig(M30) = -191.3 pA
*   Ib(M30) = 1.243 pA
*   Is(M30) = 145.7 pA
*   Id(M29) = 44.79 pA
*   Ig(M29) = -60.92 pA
*   Is(M29) = 16.26 pA
*   Id(M28) = 146.1 pA
*   Ig(M28) = -161.9 pA
*   Is(M28) = 16.37 pA
*   Id(M25) = 17.27 pA
*   Ig(M25) = -17.27 pA
*   Id(M20) = 8.92 nA
*   Ig(M20) = -16.26 pA
*   Is(M20) = -8.903 nA
*   Id(M19) = 4.574 nA
*   Is(M19) = -4.573 nA
*   Id(M18) = 4.345 nA
*   Ig(M18) = 1.772 pA
*   Is(M18) = -4.347 nA
*   Id(M17) = 44.35 pA
*   Ig(M17) = -191.3 pA
*   Ib(M17) = 1.243 pA
*   Is(M17) = 145.7 pA
*   Id(M16) = 44.79 pA
*   Ig(M16) = -60.92 pA
*   Is(M16) = 16.26 pA
*   Id(M15) = 146.1 pA
*   Ig(M15) = -161.9 pA
*   Is(M15) = 16.37 pA
*   Id(M12) = 7.02 pA
*   Ig(M12) = -7.02 pA
*   Id(M6) = 6.962 nA
*   Ig(M6) = -6.106 pA
*   Is(M6) = -6.955 nA
*   Id(M5) = 5.242 nA
*   Ig(M5) = -1.737 pA
*   Is(M5) = -5.24 nA
*   Id(M4) = 1.718 nA
*   Ig(M4) = 3.785 pA
*   Is(M4) = -1.722 nA
*   Id(M3) = 44.53 pA
*   Ig(M3) = -144.9 pA
*   Is(M3) = 100 pA
*   Id(M2) = 44.91 pA
*   Ig(M2) = -50.77 pA
*   Is(M2) = 6.103 pA
*   Id(M1) = 100.4 pA
*   Ig(M1) = -106.1 pA
*   Is(M1) = 6.148 pA
*   I(V24) = 58.84 pA
*   I(V23) = -27.73 nA
*   I(V22) = 5.971 nA
*   I(V20) = -9.263 nA
*   I(V18) = -89.14 pA
*   I(V15) = -9.263 nA
*   I(V13) = -89.14 pA
*   I(V10) = -9.263 nA
*   I(V8) = -89.14 pA
*   I(V5) = -10.66 nA
*   I(V3) = 54.88 pA
*   I(V2) = -89.44 pA
*   I(V1) = 1.544 nA
*   Ix(x1:IN) = -5.971 nA
*   Ix(x1:~EN) = 27.73 nA
*   Ix(x1:OUT) = 3.481 nA
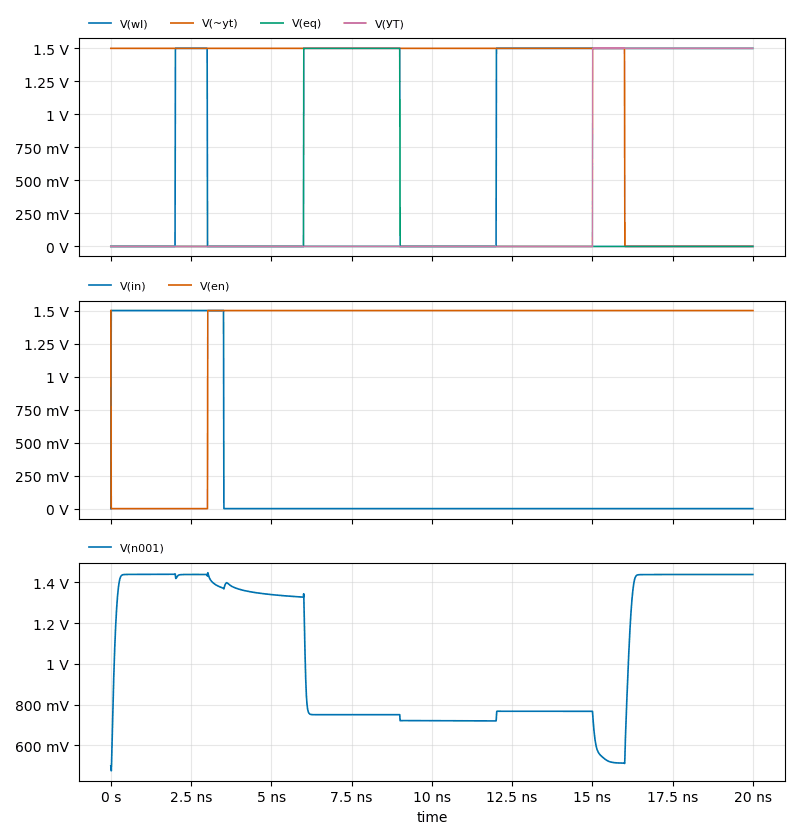
[diagram p4: Transient Analysis of Draft2.asc, plotted from the saved traces]
* Transient Analysis, 1 run:
*   V(wl): min 0 V, max 1.5 V, average 674.6 mV, rms 1.006 V, last 1.5 V
*   V(~yt): min 0 V, max 1.5 V, average 1.2 V, rms 1.342 V, last 0 V
*   V(eq): min 0 V, max 1.5 V, average 225 mV, rms 580.6 mV, last 0 V
*   V(УТ): min 0 V, max 1.5 V, average 374.6 mV, rms 749.5 mV, last 1.5 V
*   V(in): min 0 V, max 1.5 V, average 263.2 mV, rms 628.1 mV, last 0 V
*   V(en): min 0 V, max 1.5 V, average 1.274 V, rms 1.382 V, last 1.5 V
*   V(n001): min 474.4 mV, max 1.447 V, average 1.06 V, rms 1.115 V, last 1.438 V